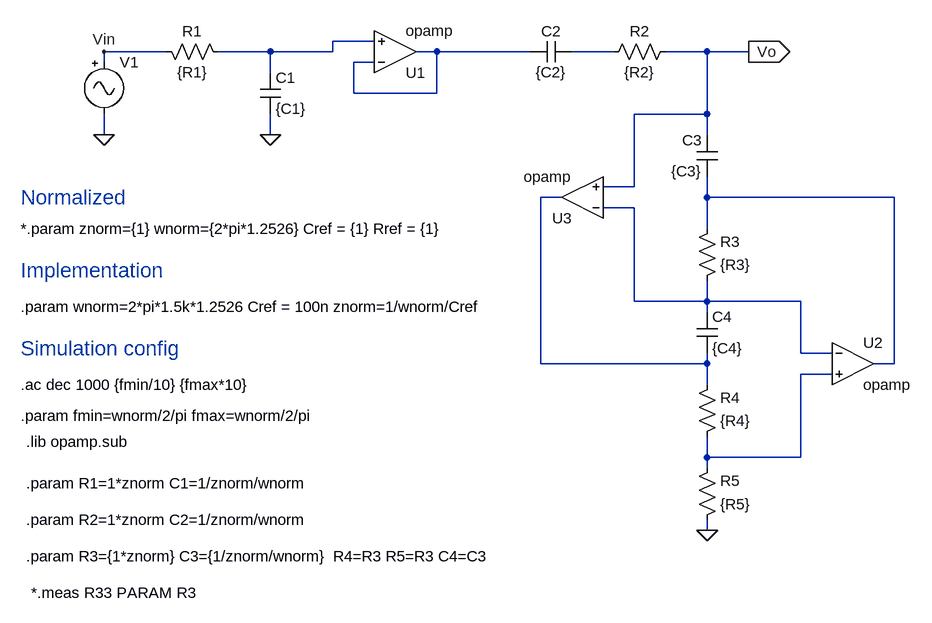
[diagram p0: schematic ts3 fdnr.asc]
ts3 fdnr.asc, the LTspice schematic file:
Version 4
SHEET 1 1028 1048
WIRE 32 16 -32 16
WIRE -288 32 -384 32
WIRE -128 32 -208 32
WIRE -32 32 -32 16
WIRE -32 32 -128 32
WIRE 128 32 96 32
WIRE 272 32 128 32
WIRE 400 32 336 32
WIRE 544 32 480 32
WIRE 608 32 544 32
WIRE -384 48 -384 32
WIRE 32 48 0 48
WIRE -128 64 -128 32
WIRE 0 96 0 48
WIRE 128 96 128 32
WIRE 128 96 0 96
WIRE 544 128 544 32
WIRE 544 128 432 128
WIRE -384 160 -384 128
WIRE -128 160 -128 128
WIRE 544 160 544 128
WIRE 432 240 432 128
WIRE 432 240 384 240
WIRE 320 256 288 256
WIRE 544 256 544 224
WIRE 832 256 544 256
WIRE 432 272 384 272
WIRE 544 304 544 256
WIRE 432 416 432 272
WIRE 544 416 544 384
WIRE 544 416 432 416
WIRE 688 416 544 416
WIRE 544 432 544 416
WIRE 688 496 688 416
WIRE 736 496 688 496
WIRE 288 512 288 256
WIRE 544 512 544 496
WIRE 544 512 288 512
WIRE 832 512 832 256
WIRE 832 512 800 512
WIRE 736 528 688 528
WIRE 544 544 544 512
WIRE 544 656 544 624
WIRE 688 656 688 528
WIRE 688 656 544 656
WIRE 544 672 544 656
WIRE 544 768 544 752
FLAG -384 160 0
FLAG -384 32 Vin
FLAG 608 32 Vo
IOPIN 608 32 Out
FLAG -128 160 0
FLAG 544 768 0
SYMBOL res -192 48 M270
WINDOW 0 32 56 VTop 2
WINDOW 3 0 56 VBottom 2
SYMATTR InstName R1
SYMATTR Value {R1}
SYMBOL Misc/signal -384 32 R0
WINDOW 39 0 0 Left 0
SYMATTR InstName V1
SYMATTR Value2 AC 1 0
SYMATTR Value ""
SYMBOL cap -144 64 R0
SYMATTR InstName C1
SYMATTR Value {C1}
SYMBOL cap 560 160 M0
SYMATTR InstName C3
SYMATTR Value {C3}
SYMBOL res 528 640 M180
WINDOW 0 36 76 Left 2
WINDOW 3 36 40 Left 2
SYMATTR InstName R4
SYMATTR Value {R4}
SYMBOL Opamps/opamp 64 96 M180
SYMATTR InstName U1
SYMBOL Opamps/opamp 768 448 R0
SYMATTR InstName U2
SYMBOL Opamps/opamp 352 320 R180
SYMATTR InstName U3
SYMBOL res 496 16 R90
WINDOW 0 0 56 VBottom 2
WINDOW 3 32 56 VTop 2
SYMATTR InstName R2
SYMATTR Value {R2}
SYMBOL res 528 768 M180
WINDOW 0 36 76 Left 2
WINDOW 3 36 40 Left 2
SYMATTR InstName R5
SYMATTR Value {R5}
SYMBOL res 528 400 M180
WINDOW 0 36 76 Left 2
WINDOW 3 36 40 Left 2
SYMATTR InstName R3
SYMATTR Value {R3}
SYMBOL cap 528 496 M180
WINDOW 0 24 56 Left 2
WINDOW 3 24 8 Left 2
SYMATTR InstName C4
SYMATTR Value {C4}
SYMBOL cap 336 16 R90
WINDOW 0 0 32 VBottom 2
WINDOW 3 32 32 VTop 2
SYMATTR InstName C2
SYMATTR Value {C2}
TEXT -504 632 Left 2 !.lib opamp.sub
TEXT -512 424 Left 2 !.param wnorm=2*pi*1.5k*1.2526 Cref = 100n znorm=1/wnorm/Cref
TEXT -512 368 Left 3 ;Implementation
TEXT -512 256 Left 3 ;Normalized
TEXT -512 304 Left 2 !*.param znorm={1} wnorm={2*pi*1.2526} Cref = {1} Rref = {1}
TEXT -512 544 Left 2 !.ac dec 1000 {fmin/10} {fmax*10}
TEXT -512 488 Left 3 ;Simulation config
TEXT -512 592 Left 2 !.param fmin=wnorm/2/pi fmax=wnorm/2/pi
TEXT -504 696 Left 2 !.param R1=1*znorm C1=1/znorm/wnorm
TEXT -504 752 Left 2 !.param R2=1*znorm C2=1/znorm/wnorm
TEXT -504 808 Left 2 !.param R3={1*znorm} C3={1/znorm/wnorm}  R4=R3 R5=R3 C4=C3
TEXT -496 864 Left 2 !*.meas R33 PARAM R3

The netlist it stands for:
* ts3 fdnr.asc
R1 N001 Vin {R1}
V1 Vin 0 AC 1 0
C1 N001 0 {C1}
C3 Vo N005 {C3}
R4 N007 N004 {R4}
XU1 N002 N001 N002 opamp Aol=100K GBW=10Meg  ; pins invin noninvin out
XU2 N006 N007 N005 opamp Aol=100K GBW=10Meg  ; pins invin noninvin out
XU3 N006 Vo N004 opamp Aol=100K GBW=10Meg  ; pins invin noninvin out
R2 Vo N003 {R2}
R5 0 N007 {R5}
R3 N006 N005 {R3}
C4 N004 N006 {C4}
C2 N003 N002 {C2}
.lib opamp.sub
.param wnorm=2*pi*1.5k*1.2526 Cref = 100n znorm=1/wnorm/Cref
* Implementation
* Normalized
*.param znorm={1} wnorm={2*pi*1.2526} Cref = {1} Rref = {1}
.ac dec 1000 {fmin/10} {fmax*10}
* Simulation config
.param fmin=wnorm/2/pi fmax=wnorm/2/pi
.param R1=1*znorm C1=1/znorm/wnorm
.param R2=1*znorm C2=1/znorm/wnorm
.param R3={1*znorm} C3={1/znorm/wnorm}  R4=R3 R5=R3 C4=C3
*.meas R33 PARAM R3
.backanno
.end